# EAGLE design Brians test board 1 (EAGLE 6.5.0)
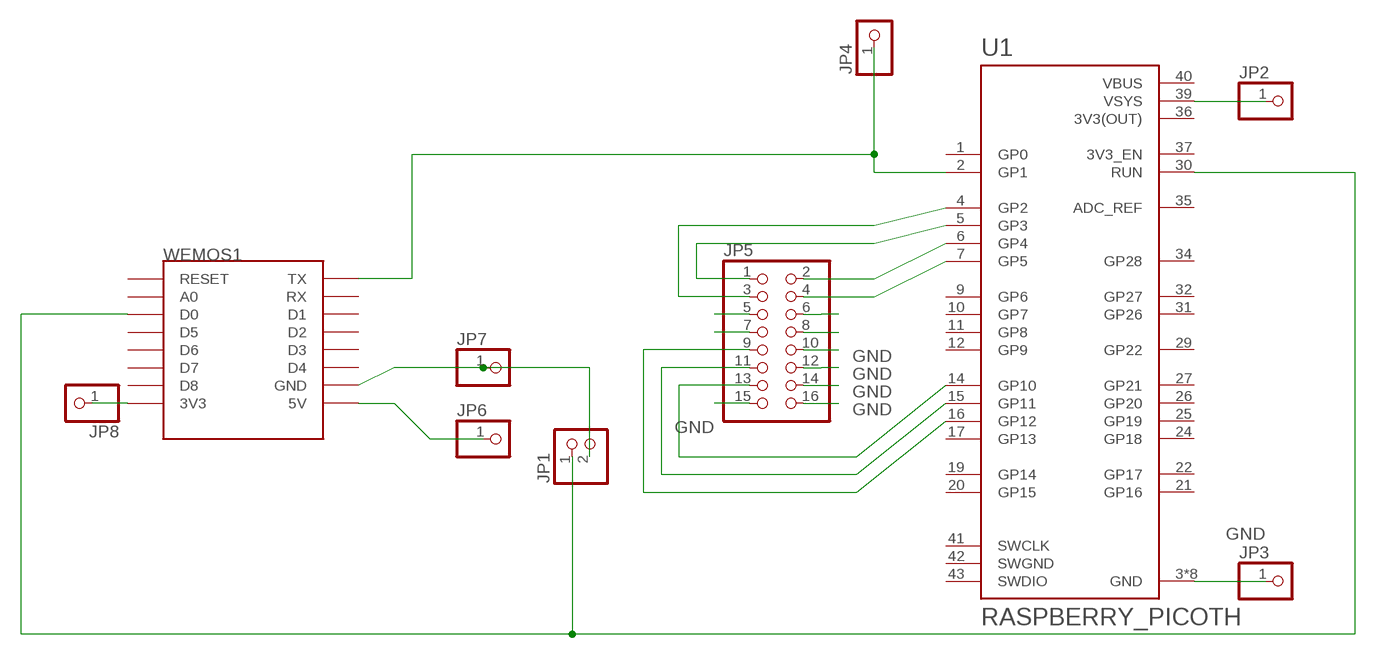
[diagram p0: schematic, sheet 1]

## Parts
JP1  PINHD-1X2  [1X02]
JP2  PINHD-1X1  [1X01]
JP3  PINHD-1X1  [1X01]
JP4  PINHD-1X1  [1X01]
JP5  PINHD-2X8  [2X08]
JP6  PINHD-1X1  [1X01]
JP7  PINHD-1X1  [1X01]
JP8  PINHD-1X1  [1X01]
U1  RASPBERRY_PICOTH  [PICO-PKG-TH]
WEMOS1  WEMOS-D1-MINI  [WEMOS-D1-MINI]

## Nets
GND: JP3.1 JP5.10 JP5.12 JP5.14 JP5.15 JP5.16 U1.3(GND) U1.8(GND) U1.13(GND) U1.18(GND) U1.23(GND) U1.28(GND) U1.33(GND) U1.38(GND)
N$1: JP1.2 JP7.1 WEMOS1.GND
N$2: JP6.1 WEMOS1.5V
N$3: JP5.1 U1.5(GP3)
N$4: JP8.1 WEMOS1.3V3
N$5: JP2.1 U1.39(VSYS)
N$6: JP1.1 U1.30(RUN) WEMOS1.D0
N$7: JP4.1 U1.2(GP1) WEMOS1.TX
N$8: JP5.3 U1.4(GP2)
N$10: JP5.13 U1.14(GP10)
N$11: JP5.11 U1.15(GP11)
N$12: JP5.9 U1.16(GP12)
N$13: JP5.2 U1.6(GP4)
N$14: JP5.4 U1.7(GP5)
N$50: JP5.5
N$54: JP5.8
N$55: JP5.6
N$57: JP5.7
Unconnected: U1.1(GP0) U1.9(GP6) U1.10(GP7) U1.11(GP8) U1.12(GP9) U1.17(GP13) U1.19(GP14) U1.20(GP15) U1.21(GP16) U1.22(GP17) U1.24(GP18) U1.25(GP19) U1.26(GP20) U1.27(GP21) U1.29(GP22) U1.31(GP26) U1.32(GP27) U1.34(GP28) U1.35(ADC_REF) U1.37(3V3_EN) U1.41(SWCLK) U1.43(SWDIO) WEMOS1.A0 WEMOS1.D1 WEMOS1.D2 WEMOS1.D3 WEMOS1.D4 WEMOS1.D5 WEMOS1.D6 WEMOS1.D7 WEMOS1.D8 WEMOS1.RESET WEMOS1.RX

## Power pins joined to a net without a drawn wire
3V3(OUT): U1.36(3V3(OUT))
SWGND: U1.42(SWGND)
VBUS: U1.40(VBUS)

## Library data of the parts
JP1 = pinhead:PINHD-1X2: PIN HEADER
JP2-JP4 JP6-JP8 = pinhead:PINHD-1X1: PIN HEADER
JP5 = pinhead:PINHD-2X8: PIN HEADER
U1 = RpiPico:RASPBERRY_PICO: Raspberry Pi Pico
WEMOS1 = esp8266modules:WEMOS-D1-MINI: WeMos.cc D1 mini ESP8266 module

## Board
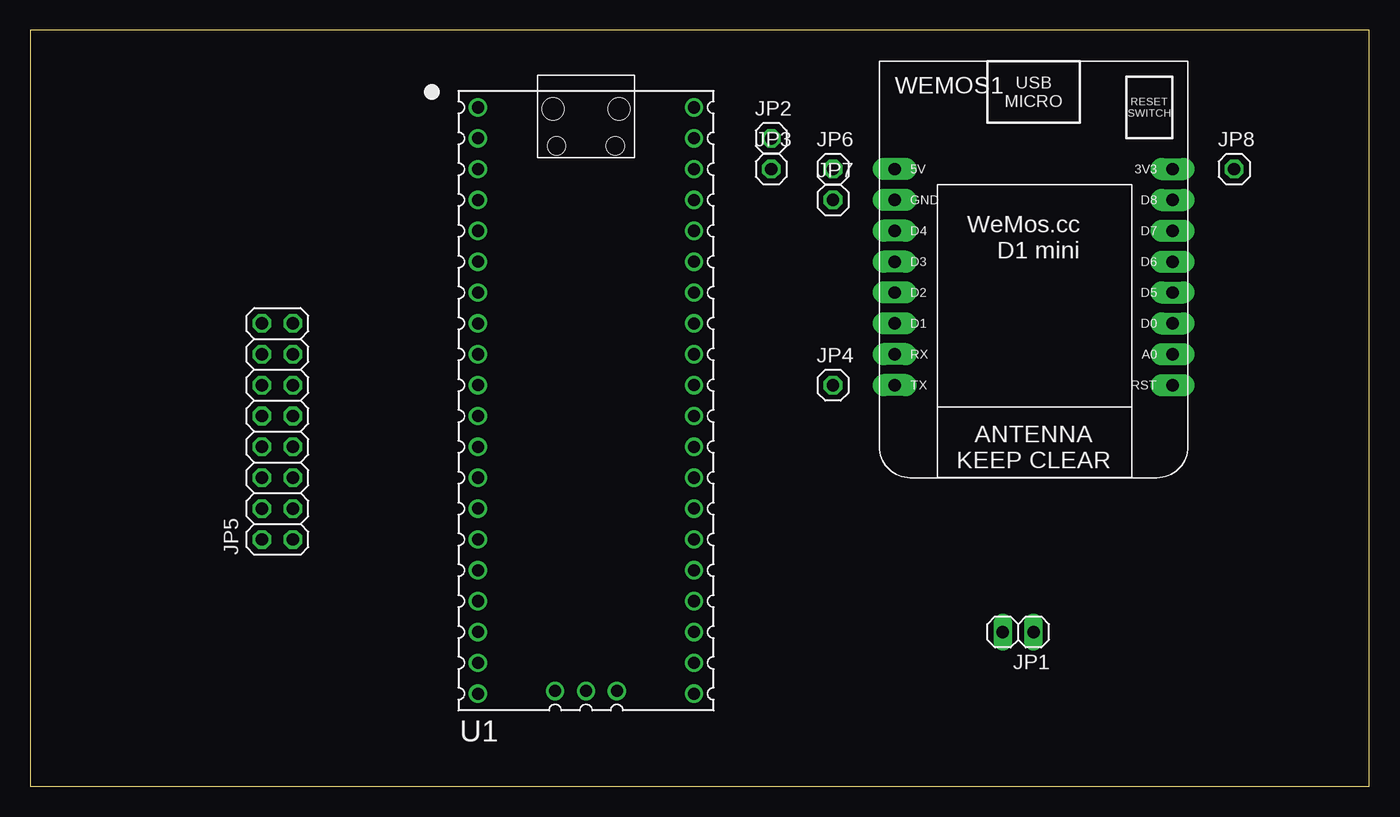
[diagram p1: board, top side]
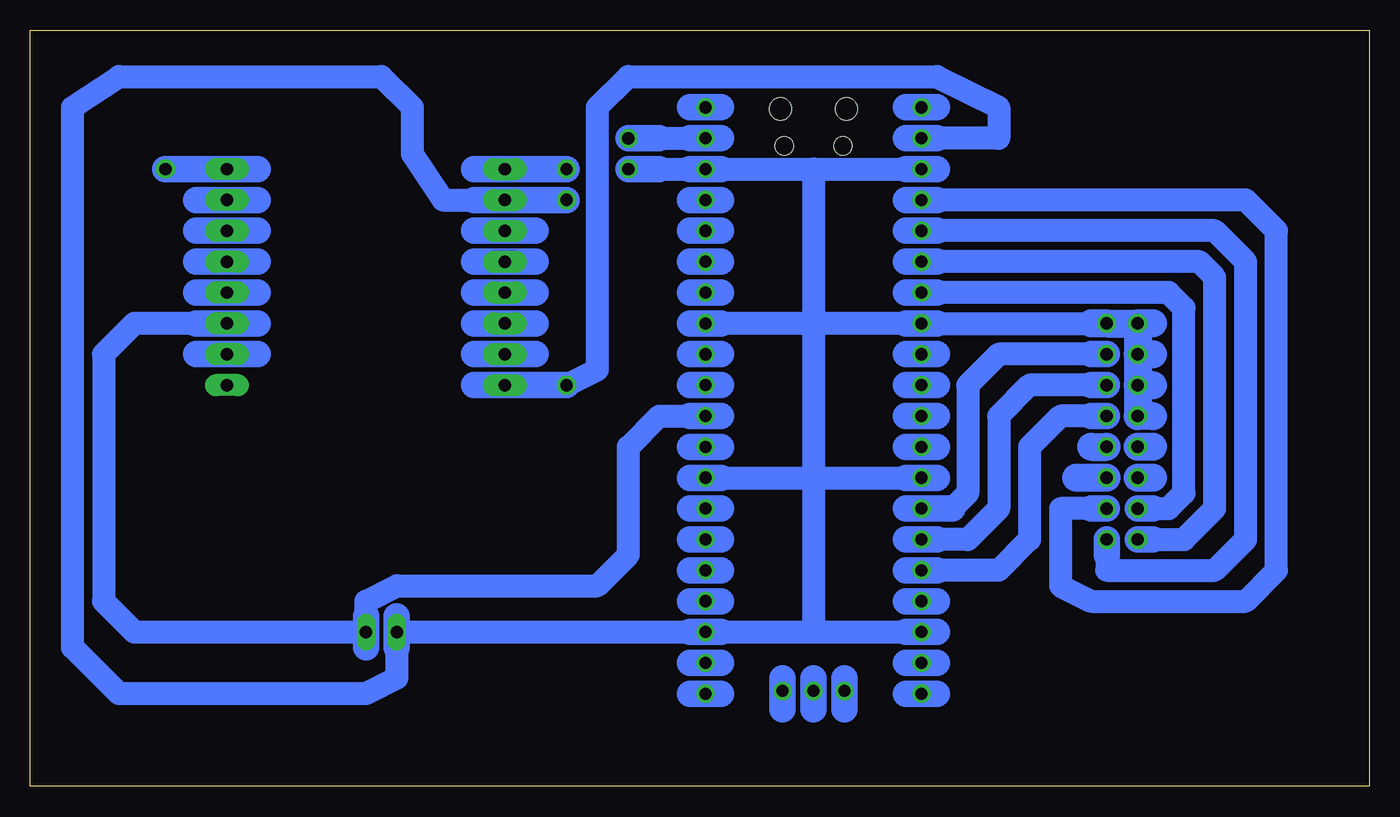
[diagram p2: board, bottom side, seen from below]

Size 110.16 x 62.22 mm. Coordinates in mm from the lower left corner, seen from the top.
Outline: 0,0 110.16,0 110.16,62.22 0,62.22 0,0
Copper layers (1*16): Top 0.035mm / dielectric 1.5mm / Bottom 0.035mm
Design rules "default": minimum track width 10mil, minimum drill 24mil, track to track 8mil, track to pad 8mil, pad to pad 8mil, via to via 8mil, smd to smd 8mil, copper to edge 40mil, drill to drill 8mil, minimum pad ring 10mil, minimum via ring 8mil, stop-mask expansion 4mil, vias tented up to drill 0mil, thermal gap 10mil

### Footprints (pad centres in the part's own frame; a part is rotated, then mirrored left to right if it is on the bottom)
1X02 = drill 1.016 long: 1 -1.27,0; 2 1.27,0
1X01 = drill 1.016 octagon: 1 0,0
2X08 = drill 1.016 octagon: 1 -8.89,-1.27; 2 -8.89,1.27; 3 -6.35,-1.27; 4 -6.35,1.27; 5 -3.81,-1.27; 6 -3.81,1.27; 7 -1.27,-1.27; 8 -1.27,1.27; 9 1.27,-1.27; 10 1.27,1.27; 11 3.81,-1.27; 12 3.81,1.27; 13 6.35,-1.27; 14 6.35,1.27; 15 8.89,-1.27; 16 8.89,1.27
PICO-PKG-TH = drill 1: 1 -8.89,24.13; 2 -8.89,21.59; 3 -8.89,19.05; 4 -8.89,16.51; 5 -8.89,13.97; 6 -8.89,11.43; 7 -8.89,8.89; 8 -8.89,6.35; 9 -8.89,3.81; 10 -8.89,1.27; 11 -8.89,-1.27; 12 -8.89,-3.81; 13 -8.89,-6.35; 14 -8.89,-8.89; 15 -8.89,-11.43; 16 -8.89,-13.97; 17 -8.89,-16.51; 18 -8.89,-19.05; 19 -8.89,-21.59; 20 -8.89,-24.13; 21 8.89,-24.13; 22 8.89,-21.59; 23 8.89,-19.05; 24 8.89,-16.51; 25 8.89,-13.97; 26 8.89,-11.43; 27 8.89,-8.89; 28 8.89,-6.35; 29 8.89,-3.81; 30 8.89,-1.27; 31 8.89,1.27; 32 8.89,3.81; 33 8.89,6.35; 34 8.89,8.89; 35 8.89,11.43; 36 8.89,13.97; 37 8.89,16.51; 38 8.89,19.05; 39 8.89,21.59; 40 8.89,24.13; 41 -2.54,-23.9; 42 0,-23.9; 43 2.54,-23.9 | hole 1.8: -2.725,24; 2.725,24 | hole 1.5: -2.425,20.97; 2.425,20.97
WEMOS-D1-MINI = drill 1.016 pad 1.829 long: 3V3 -10.16,-10.16; 5V 12.7,-10.16; A0 -10.16,5.08; D0 -10.16,2.54; D1 12.7,2.54; D2 12.7,0; D3 12.7,-2.54; D4 12.7,-5.08; D5 -10.16,0; D6 -10.16,-2.54; D7 -10.16,-5.08; D8 -10.16,-7.62; GND 12.7,-7.62; RESET -10.16,7.62; RX 12.7,5.08; TX 12.7,7.62

### Placement (x,y rotation side)
JP1  81.28,12.7 180 top
JP2  60.96,53.34 0 top
JP3  60.96,50.8 0 top
JP4  66.04,33.02 0 top
JP5  20.32,29.21 90 top
JP6  66.04,50.8 0 top
JP7  66.04,48.26 0 top
JP8  99.06,50.8 0 top
U1  45.72,31.75 0 top
WEMOS1  83.82,40.64 180 top

### Tracks (layer width: path | path; a pad name or v marks a point on that pad's centre or on a via)
GND
  Bottom 0.254: U1.23 53.34,12.7
  Bottom 1.905: 78.74,12.7 55.88,12.7 | 58.42,50.8 55.88,50.8 U1.38 53.34,50.8 45.72,50.8 | 53.34,12.7 45.72,12.7 | 45.72,12.7 38.1,12.7 U1.18 | U1.28 53.34,25.4 45.72,25.4 | 45.72,25.4 38.1,25.4 U1.13 | 45.72,25.4 45.72,12.7 | 45.72,50.8 38.1,50.8 U1.3 | 45.72,38.1 38.1,38.1 U1.8 35.56,38.1 22.86,38.1 | 45.72,38.1 53.34,38.1 U1.33 | 45.72,38.1 45.72,25.4 | 45.72,50.8 45.72,38.1
  Bottom 2.184: 35.56,38.1 38.1,38.1 | 35.56,25.4 38.1,25.4 | 35.56,12.7 38.1,12.7 | 53.34,12.7 55.88,12.7 | 53.34,25.4 55.88,25.4 | 53.34,38.1 55.88,38.1 | 53.34,50.8 55.88,50.8 | 58.42,50.8 JP3.1 | 35.56,50.8 38.1,50.8
  Bottom 2.286: 17.78,30.48 JP5.10 JP5.12 | 17.78,33.02 JP5.12 | JP5.14 17.78,35.56 | 17.78,38.1 JP5.16 | 22.86,38.1 JP5.15 JP5.16 | JP5.16 JP5.14 | JP5.14 JP5.12
N$1
  Bottom 1.905: JP1.2 80.01,11.43 80.01,8.89 82.55,7.62 102.87,7.62 106.68,11.43 106.68,55.88 102.87,58.42 81.28,58.42 78.74,55.88 78.74,52.07 76.2,48.26 73.66,48.26
  Bottom 2.184: JP7.1 WEMOS1.GND 73.66,48.26 | 80.01,13.97 80.01,11.43
N$2
  Bottom 1.905: WEMOS1.5V 68.58,50.8
  Bottom 2.184: JP6.1 68.58,50.8 73.66,50.8
N$3
  Bottom 1.905: 21.59,19.05 21.59,17.78 12.7,17.78 10.16,20.32 10.16,43.18 12.7,45.72 35.56,45.72 U1.5
  Bottom 2.184: 38.1,45.72 35.56,45.72 | JP5.1 21.59,19.05
N$4
  Bottom 1.905: WEMOS1.3V3 JP8.1
  Bottom 2.184: 91.44,50.8 JP8.1
N$5
  Bottom 1.905: 58.42,53.34 55.88,53.34 U1.39
  Bottom 2.184: 53.34,53.34 55.88,53.34 | 58.42,53.34 JP2.1
N$6
  Bottom 1.905: WEMOS1.D0 96.52,38.1 101.6,38.1 104.14,35.56 104.14,15.24 101.6,12.7 JP1.1 82.55,13.97 82.55,15.24 80.01,16.51 63.5,16.51 60.96,19.05 60.96,27.94 58.42,30.48 55.88,30.48 U1.30
  Bottom 2.184: 53.34,30.48 55.88,30.48 | 91.44,38.1 96.52,38.1 | 82.55,11.43 82.55,13.97
N$7
  Bottom 1.905: 68.58,33.02 WEMOS1.TX | U1.2 35.56,53.34 30.48,53.34 30.48,55.88 35.56,58.42 60.96,58.42 63.5,55.88 63.5,34.29 JP4.1
  Bottom 2.184: 73.66,33.02 68.58,33.02 JP4.1 | 38.1,53.34 35.56,53.34
N$8
  Bottom 1.905: 22.86,22.86 25.4,22.86 25.4,16.51 22.86,15.24 10.16,15.24 7.62,17.78 7.62,45.72 10.16,48.26 35.56,48.26 U1.4
  Bottom 2.184: 35.56,48.26 38.1,48.26 | 22.86,22.86 JP5.3
N$10
  Bottom 1.905: U1.14 34.29,22.86 33.02,24.13 33.02,33.02 30.48,35.56 22.86,35.56
  Bottom 2.184: 34.29,22.86 38.1,22.86 | 22.86,35.56 JP5.13
N$11
  Bottom 1.905: U1.15 35.56,20.32 33.02,20.32 30.48,22.86 30.48,30.48 27.94,33.02 22.86,33.02
  Bottom 2.184: 35.56,20.32 38.1,20.32 | 22.86,33.02 JP5.11
N$12
  Bottom 1.905: U1.16 35.56,17.78 30.48,17.78 27.94,20.32 27.94,27.94 25.4,30.48 22.86,30.48
  Bottom 2.184: 35.56,17.78 38.1,17.78 | 22.86,30.48 JP5.9
N$13
  Bottom 1.905: 17.78,20.32 15.24,20.32 12.7,22.86 12.7,41.91 13.97,43.18 35.56,43.18 U1.6
  Bottom 2.184: 38.1,43.18 35.56,43.18 | JP5.2 17.78,20.32
N$14
  Bottom 1.905: 17.78,22.86 16.51,22.86 15.24,24.13 15.24,39.37 16.51,40.64 35.56,40.64 U1.7
  Bottom 2.184: 35.56,40.64 38.1,40.64 | 17.78,22.86 JP5.4
N$15
  Bottom 2.184: 35.56,35.56 38.1,35.56
N$16
  Bottom 2.184: 35.56,33.02 38.1,33.02
N$17
  Bottom 2.184: 35.56,30.48 38.1,30.48
N$18
  Bottom 2.184: 35.56,27.94 38.1,27.94
N$19
  Bottom 2.184: 35.56,15.24 38.1,15.24
N$20
  Bottom 2.184: 35.56,10.16 38.1,10.16
N$21
  Bottom 2.184: 35.56,7.62 38.1,7.62
N$22
  Bottom 2.184: 43.18,8.89 43.18,6.35
N$23
  Bottom 2.184: 45.72,8.89 45.72,6.35
N$24
  Bottom 2.184: 48.26,8.89 48.26,6.35
N$25
  Bottom 2.184: 53.34,7.62 55.88,7.62
N$26
  Bottom 2.184: 53.34,10.16 55.88,10.16
N$27
  Bottom 2.184: 53.34,15.24 55.88,15.24
N$28
  Bottom 2.184: 53.34,17.78 55.88,17.78
N$29
  Bottom 2.184: 55.88,20.32 53.34,20.32
N$30
  Bottom 2.184: 53.34,22.86 55.88,22.86
N$31
  Bottom 2.184: 53.34,27.94 55.88,27.94
N$32
  Bottom 2.184: 55.88,33.02 53.34,33.02
N$33
  Bottom 2.184: 53.34,35.56 55.88,35.56
N$34
  Bottom 2.184: 53.34,40.64 55.88,40.64
N$35
  Bottom 2.184: 53.34,43.18 55.88,43.18
N$36
  Bottom 2.184: 53.34,45.72 55.88,45.72
N$37
  Bottom 2.184: 53.34,48.26 55.88,48.26
N$38
  Bottom 2.184: 53.34,55.88 55.88,55.88
N$39
  Bottom 2.184: 68.58,45.72 73.66,45.72
N$40
  Bottom 2.184: 68.58,43.18 73.66,43.18
N$41
  Bottom 2.184: 68.58,40.64 71.12,40.64 73.66,40.64
N$42
  Bottom 2.184: 68.58,38.1 71.12,38.1 73.66,38.1
N$43
  Bottom 2.184: 68.58,35.56 73.66,35.56
N$44
  Bottom 2.184: 91.44,48.26 96.52,48.26
N$45
  Bottom 2.184: 91.44,45.72 96.52,45.72
N$46
  Bottom 2.184: 91.44,43.18 96.52,43.18
N$47
  Bottom 2.184: 91.44,40.64 96.52,40.64
N$48
  Bottom 2.184: 91.44,35.56 96.52,35.56
N$49
  Bottom 2.184: 38.1,55.88 35.56,55.88
N$50
  Bottom 2.286: 24.13,25.4 22.86,25.4 JP5.5
N$54
  Bottom 2.286: 17.78,27.94 JP5.8
N$55
  Bottom 2.286: 17.78,25.4 JP5.6
N$57
  Bottom 2.286: 22.86,27.94 JP5.7